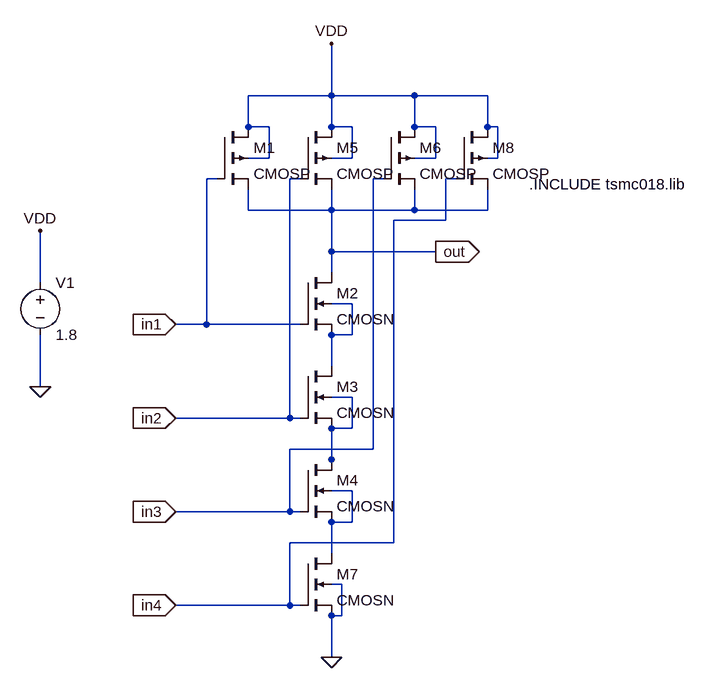
[diagram p0: schematic nand4.asc]
nand4.asc, the LTspice schematic file:
Version 4
SHEET 1 880 680
WIRE 144 -384 144 -464
WIRE 144 -384 16 -384
WIRE 272 -384 144 -384
WIRE 384 -384 272 -384
WIRE 16 -336 16 -384
WIRE 48 -336 16 -336
WIRE 144 -336 144 -384
WIRE 176 -336 144 -336
WIRE 272 -336 272 -384
WIRE 304 -336 272 -336
WIRE 384 -336 384 -384
WIRE 400 -336 384 -336
WIRE 48 -288 48 -336
WIRE 48 -288 16 -288
WIRE 176 -288 176 -336
WIRE 176 -288 144 -288
WIRE 304 -288 304 -336
WIRE 304 -288 272 -288
WIRE 400 -288 400 -336
WIRE 400 -288 384 -288
WIRE -32 -256 -48 -256
WIRE 96 -256 80 -256
WIRE 224 -256 208 -256
WIRE 336 -256 320 -256
WIRE 16 -208 16 -240
WIRE 144 -208 144 -240
WIRE 144 -208 16 -208
WIRE 272 -208 272 -240
WIRE 272 -208 144 -208
WIRE 384 -208 384 -240
WIRE 384 -208 272 -208
WIRE 320 -192 320 -256
WIRE 320 -192 240 -192
WIRE 144 -144 144 -208
WIRE 304 -144 144 -144
WIRE 144 -112 144 -144
WIRE -304 -96 -304 -176
WIRE 176 -64 144 -64
WIRE -48 -32 -48 -256
WIRE -48 -32 -96 -32
WIRE 96 -32 -48 -32
WIRE 176 -16 176 -64
WIRE 176 -16 144 -16
WIRE 144 32 144 -16
WIRE -304 64 -304 -16
WIRE 176 80 144 80
WIRE 80 112 80 -256
WIRE 80 112 -96 112
WIRE 96 112 80 112
WIRE 176 128 176 80
WIRE 176 128 144 128
WIRE 208 160 208 -256
WIRE 208 160 80 160
WIRE 144 176 144 128
WIRE 144 192 144 176
WIRE 176 224 144 224
WIRE 80 256 80 160
WIRE 80 256 -96 256
WIRE 96 256 80 256
WIRE 176 272 176 224
WIRE 176 272 144 272
WIRE 240 304 240 -192
WIRE 240 304 80 304
WIRE 144 320 144 272
WIRE 160 368 144 368
WIRE 80 400 80 304
WIRE 80 400 -96 400
WIRE 96 400 80 400
WIRE 160 416 160 368
WIRE 160 416 144 416
WIRE 144 480 144 416
FLAG 144 -464 VDD
FLAG -96 -32 in1
IOPIN -96 -32 In
FLAG 304 -144 out
IOPIN 304 -144 Out
FLAG -304 64 0
FLAG -304 -176 VDD
FLAG -96 112 in2
IOPIN -96 112 In
FLAG -96 256 in3
IOPIN -96 256 In
FLAG -96 400 in4
IOPIN -96 400 In
FLAG 144 480 0
SYMBOL cmosp -32 -336 R0
SYMATTR InstName M1
SYMATTR Value2 l=180n w=360n
SYMBOL cmosn 96 -112 R0
SYMATTR InstName M2
SYMATTR Value2 l=180n w=720n
SYMBOL voltage -304 -112 R0
WINDOW 123 0 0 Left 0
WINDOW 39 0 0 Left 0
SYMATTR InstName V1
SYMATTR Value 1.8
SYMBOL cmosn 96 32 R0
SYMATTR InstName M3
SYMATTR Value2 l=180n w=720n
SYMBOL cmosn 96 176 R0
SYMATTR InstName M4
SYMATTR Value2 l=180n w=720n
SYMBOL cmosp 96 -336 R0
SYMATTR InstName M5
SYMATTR Value2 l=180n w=360n
SYMBOL cmosp 224 -336 R0
SYMATTR InstName M6
SYMATTR Value2 l=180n w=360n
SYMBOL cmosn 96 320 R0
SYMATTR InstName M7
SYMATTR Value2 l=180n w=720n
SYMBOL cmosp 336 -336 R0
SYMATTR InstName M8
SYMATTR Value2 l=180n w=360n
TEXT 448 -248 Left 2 !.INCLUDE tsmc018.lib

The netlist it stands for:
* nand4.asc
M1 VDD in1 out VDD CMOSP l=180n w=360n
M2 out in1 N001 N001 CMOSN l=180n w=720n
V1 VDD 0 1.8
M3 N001 in2 N002 N002 CMOSN l=180n w=720n
M4 N002 in3 N003 N003 CMOSN l=180n w=720n
M5 VDD in2 out VDD CMOSP l=180n w=360n
M6 VDD in3 out VDD CMOSP l=180n w=360n
M7 N003 in4 0 0 CMOSN l=180n w=720n
M8 VDD in4 out VDD CMOSP l=180n w=360n
.model NMOS NMOS
.model PMOS PMOS
.lib standard.mos
.INCLUDE tsmc018.lib
.backanno
.end